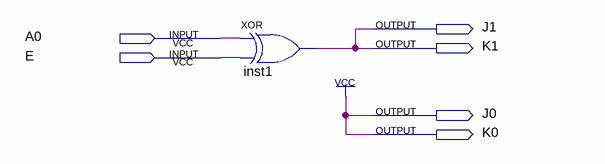
[diagram p0: schematic sheet]
// Quartus schematic Karnaugh.bdf as structural Verilog: 1 symbols, 6 pins
module Karnaugh (
  input  A0,
  input  E,
  output J1,
  output K1,
  output J0,
  output K0
);

  xor inst1 (J1, A0, E);

  assign J0 = 1'b1;
  assign K0 = 1'b1;
  assign K1 = J1;
endmodule
